# Altium schematic sheet power.SchDoc
size A3
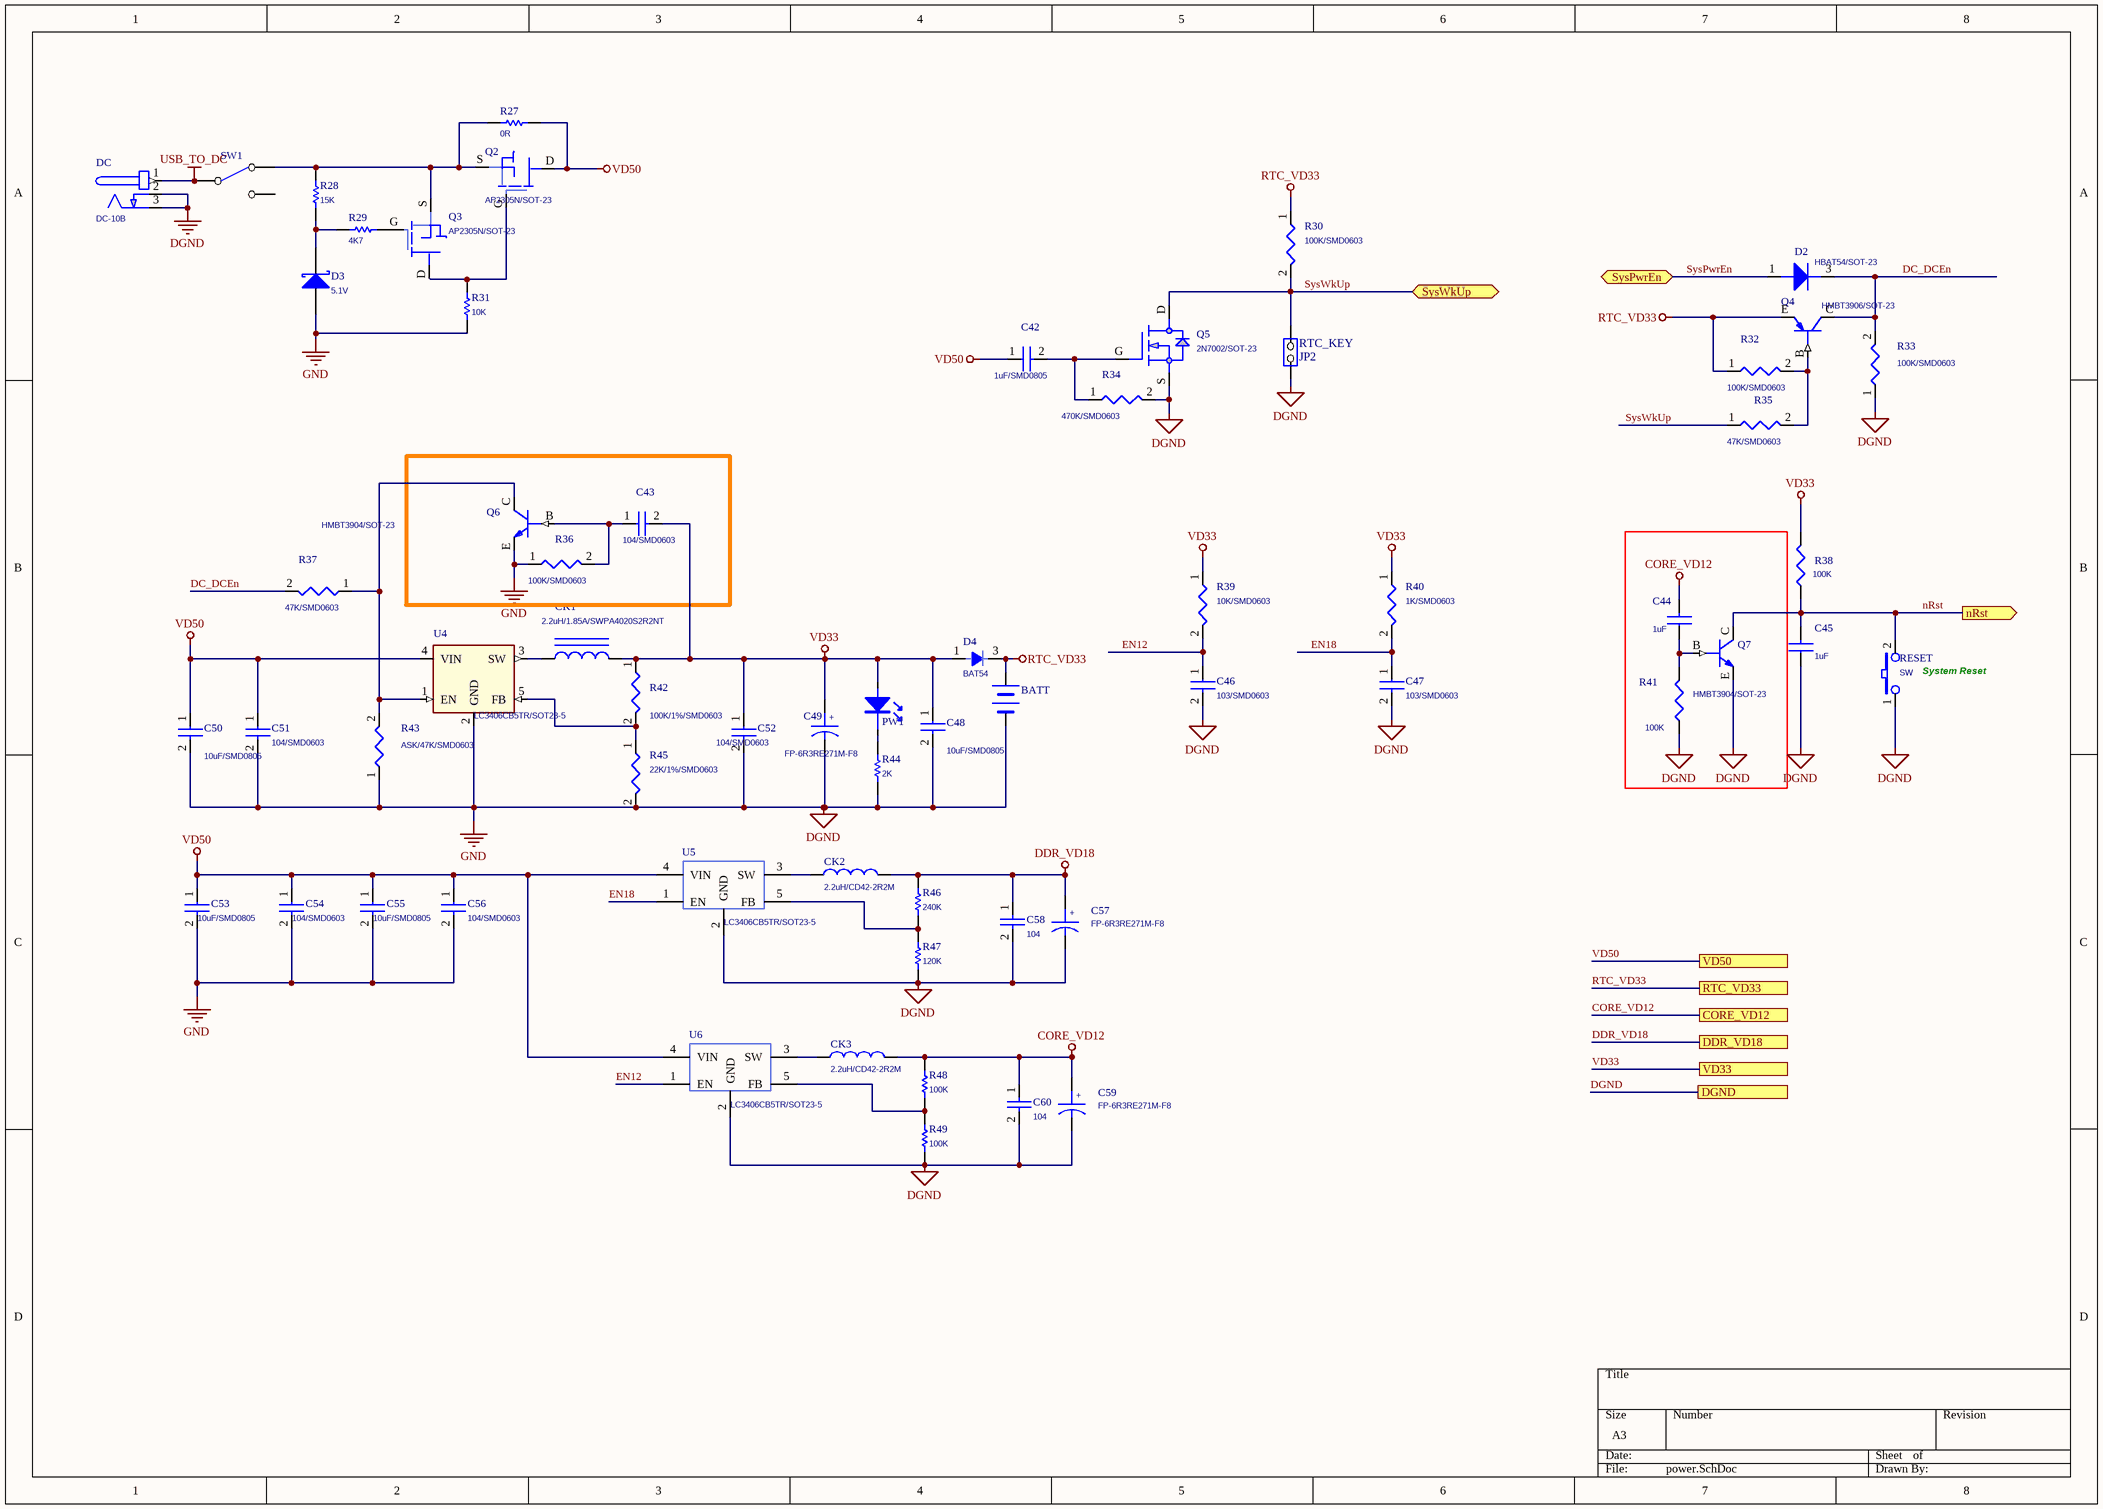
[diagram p0: power.SchDoc]

## Parts
BATT  BATTERY  [MS621]  (value not drawn)
C42  1uF/SMD0805  [C0805]
C43  104/SMD0603  [0603C]
C44  1uF  [0603C]
C45  1uF  [0603C]
C46  103/SMD0603  [0603C]
C47  103/SMD0603  [0603C]
C48  10uF/SMD0805  [C0805]
C49  FP-6R3RE271M-F8  [6R3RE271M]
C50  10uF/SMD0805  [C0805]
C51  104/SMD0603  [0603C]
C52  104/SMD0603  [0603C]
C53  10uF/SMD0805  [C0805]
C54  104/SMD0603  [0603C]
C55  10uF/SMD0805  [C0805]
C56  104/SMD0603  [0603C]
C57  FP-6R3RE271M-F8  [6R3RE271M]
C58  104  [0603C]
C59  FP-6R3RE271M-F8  [6R3RE271M]
C60  104  [0603C]
CK1  2.2uH/1.85A/SWPA4020S2R2NT  [C1210_M]
CK2  2.2uH/CD42-2R2M  [C1210_M]
CK3  2.2uH/CD42-2R2M  [C1210_M]
D2  HBAT54/SOT-23  [SOT-23_HBAT54]
D3  5.1V  [SOD-123_1N5819HW]
D4  BAT54  [BAT54]
DC  DC-10B  [DC-JACK]
PW1  red  [LED-0603]  (value not drawn)
Q2  AP2305N/SOT-23  [AP2305N_SOT23]
Q3  AP2305N/SOT-23  [AP2305N_SOT23]
Q4  HMBT3906/SOT-23  [SOT-23_HMBT3906]
Q5  2N7002/SOT-23  [SOT-23_H2N7002]
Q6  HMBT3904/SOT-23  [SOT-23_HMBT3904]
Q7  HMBT3904/SOT-23  [SOT-23_HMBT3904]
R27  0R  [0603C]
R28  15K  [0603C]
R29  4K7  [0603C]
R30  100K/SMD0603  [0603R]
R31  10K  [0603C]
R32  100K/SMD0603  [0603R]
R33  100K/SMD0603  [0603R]
R34  470K/SMD0603  [0603R]
R35  47K/SMD0603  [0603R]
R36  100K/SMD0603  [0603R]
R37  47K/SMD0603  [0603R]
R38  100K  [0603R]
R39  10K/SMD0603  [0603R]
R40  1K/SMD0603  [0603R]
R41  100K  [0603R]
R42  100K/1%/SMD0603  [0603R]
R43  ASK/47K/SMD0603  [0603R]
R44  2K  [0603R]
R45  22K/1%/SMD0603  [0603R]
R46  240K  [0603R]
R47  120K  [0603R]
R48  100K  [0603R]
R49  100K  [0603R]
RESET  SW  [SW-PB2]
RTC_KEY  JP2  [mhdr1x2]
SW1  (no value)  [SS-12D07]
U4  LC3406CB5TR/SOT23-5  [SOT-23-5]
U5  LC3406CB5TR/SOT23-5  [SOT-23-5]
U6  LC3406CB5TR/SOT23-5  [SOT-23-5]

## Ports
CORE_VD12, DDR_VD18, DGND, nRst (out), RTC_VD33, SysPwrEn (bidir), SysWkUp (bidir), VD33, VD50

## Nets
CORE_VD12: C44.2 C59.1 C60.1 CK3.2 R48.2 ; port CORE_VD12
DDR_VD18: C57.1 C58.1 CK2.2 R46.2 ; port DDR_VD18
DGND: BATT.2 C45.1 C46.2 C47.2 C48.2 C49.2 C50.2 C51.2 C52.2 C53.2 C54.2 C55.2 C56.2 C57.2 C58.2 C59.2 C60.2 D3.2(A) DC.2(GND) DC.3(GND) Q5.S Q6.E(EMITTER) Q7.E(EMITTER) R31.1 R33.1 R34.2 R36.1 R41.2 R43.1 R44.1 R45.2 R47.1 R49.1 RESET.1 RTC_KEY.1(COMMON) U4.2(GND) U5.2(GND) U6.2(GND) ; port DGND  [also labelled GND]
RTC_VD33: BATT.1 D4.3 Q4.E(EMITTER) R30.1 R32.1 ; port RTC_VD33
USB_TO_DC: DC.1(+) SW1.1(COMMON)
VD33: C43.2 C48.1 C49.1 C52.1 CK1.2 D4.1 PW1.1 R38.1 R39.1 R40.1 R42.1 ; port VD33
VD50: C42.1 C50.1 C51.1 C53.1 C54.1 C55.1 C56.1 Q2.D R27.1 U4.4(VIN) U5.4(VIN) U6.4(VIN) ; port VD50
DC_DCEn: D2.3 Q4.C(COLLECTOR) R33.2 R37.2
EN12: C46.1 R39.2 U6.1(EN)
EN18: C47.1 R40.2 U5.1(EN)
nRst: C45.2 Q7.C(COLLECTOR) R38.2 RESET.2 ; port nRst
SysPwrEn: D2.1 ; port SysPwrEn
SysWkUp: Q5.D R30.2 R35.1 RTC_KEY.2(NO) ; port SysWkUp
NetC42_2: C42.2 Q5.G R34.1
NetC43_1: C43.1 Q6.B(BASE) R36.2
NetC44_1: C44.1 Q7.B(BASE) R41.1
NetCK1_1: CK1.1 U4.3(SW)
NetCK2_1: CK2.1 U5.3(SW)
NetCK3_1: CK3.1 U6.3(SW)
NetD3_1: D3.1(K) R28.1 R29.2
NetPW1_2: PW1.2 R44.2
NetQ2_G: Q2.G Q3.D R31.2
NetQ2_S: Q2.S Q3.S R27.2 R28.2 SW1.2(NC)
NetQ3_G: Q3.G R29.1
NetQ4_B: Q4.B(BASE) R32.2 R35.2
NetQ6_C: Q6.C(COLLECTOR) R37.1 R43.2 U4.1(EN)
NetR42_2: R42.2 R45.1 U4.5(FB)
NetR46_1: R46.1 R47.2 U5.5(FB)
NetR48_1: R48.1 R49.2 U6.5(FB)

Not connected (* = marked no-connect by the designer): SW1 3(NO)

## Notes on the sheet
- (near RESET) System Reset
- (in symbol CAP POL) +

## Library data of the parts
C42 C48 C50 = C/SMD0805
C43 C46 C47 C51 C52 C54 C56 = C/SMD0603
C44 C45 = CAP NP_Dup1
C49 C57 C59 = CAP POL
C53 C55 = C/SMD1206
C58 C60 = CAP: Capacitor
CK1 = INDUCTOR IRON
CK2 CK3 = INDUCTOR1
D3 = Diode 10TQ035: Schottky Rectifier; Note: Terminal 2 is the TAB and is electrically connected to the cathode; Published: 8-Jun-2000; LatestRevisionDate: 17-Jul-2002; LatestRevisionNote: Re-released for DXP Platform.; DatasheetVersion: PD-2.057B; PackageVersion: Feb-1998; PackageReference: TO-220AC; Publisher: Altium Limited; PackageDescription: TO, Thru-Hole, Vertical, Heatsink Mounted; 3 In-Line Leads (1 Absent); Pitch 2.54 mm; ComponentLink1Description: Manufacturer Link; ComponentLink1URL: http://www.irf.com/; ComponentLink2Description: Datasheet; ComponentLink2URL: http://www.irf.com/product-info/datasheets/data/10tq.pdf
DC = PJ202A
PW1 = LED
Q5 = 2N7002/SOT-23_Dup1
R27-R29 R31 R44 R46-R49 = res1: Resistor; Value: 1K; Published: 8-Jun-2000; Revision: July-2002: Re-released for DXP Platform.; Publisher: Altium Limited
R30 R32-R37 R39 R40 R42 R43 R45 = R/SMD0603
R38 R41 = R_Dup1
RESET = SW_PUSH: Text Field1: 30; Text Field2: 30
SW1 = SW SPDT